# EAGLE design untitled01 (EAGLE 8.4.0)

## Sheet 1 of 3
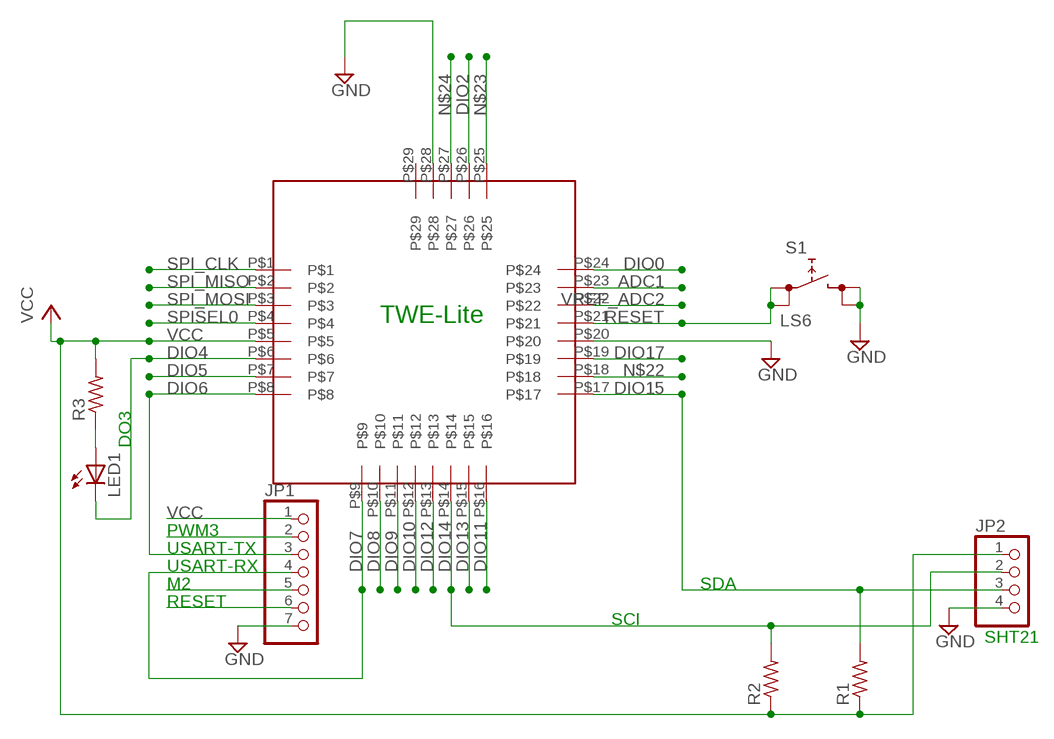
[diagram p0: schematic, sheet 1]

### Parts
JP1  PINHD-1X7  [1X07]
JP2  PINHD-1X4/90  [1X04/90]
LED1  LEDCHIP-LED0603  [CHIP-LED0603]
R1  R-US_R0805  [R0805]
R2  R-US_R0805  [R0805]
R3  R-US_R0805  [R0805]
S1  LS6  [LS6]
U$1  LITE  [LITE]

### Nets
ADC1: U$1.P$23
DIO0: U$1.P$24
DIO2: JP1.5 U$1.P$26
DIO4: LED1.C U$1.P$6
DIO5: U$1.P$7
DIO6: JP1.3 U$1.P$8
DIO7: JP1.4 U$1.P$9
DIO8: U$1.P$10
DIO9: U$1.P$11
DIO10: U$1.P$12
DIO11: U$1.P$16
DIO12: U$1.P$13
DIO13: U$1.P$15
DIO14: JP2.2 R2.2 U$1.P$14
DIO15: JP2.3 R1.2 U$1.P$17
DIO17: U$1.P$19
GND: JP1.7 JP2.4 S1.P$3 S1.P$4 U$1.P$20 U$1.P$28 ; also sheet 2,3
N$3: LED1.A R3.1
N$22: U$1.P$18
N$23: U$1.P$25
N$24: U$1.P$27
RESET: JP1.6 S1.P$1 S1.P$2 U$1.P$21
SPI_CLK: U$1.P$1
SPI_MISO: JP1.2 U$1.P$2
SPI_MOSI: U$1.P$3
SPISEL0: U$1.P$4
VCC: JP1.1 JP2.1 R1.1 R2.1 R3.2 U$1.P$5 ; also sheet 2
VREF_ADC2: U$1.P$22
Unconnected: U$1.P$29

### Notes on the sheet
- TWE-Lite
- DO3
- PWM3
- USART-TX
- USART-RX
- M2 | SDA
- RESET
- SCI
- SHT21

## Sheet 2 of 3
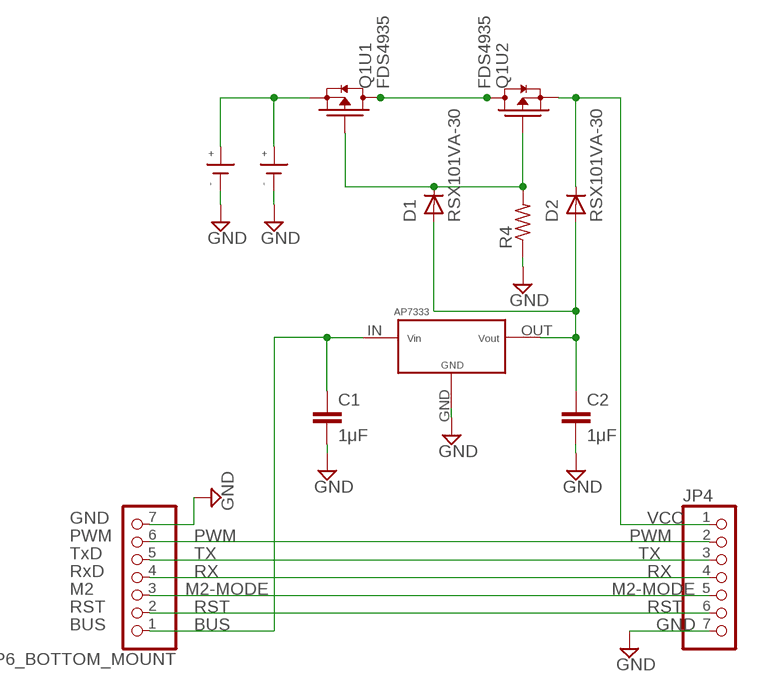
[diagram p1: schematic, sheet 2]

### Parts
C1  1μF  C-EUC1608  [C1608]
C2  1μF  C-EUC1608  [C1608]
D1  RSX101VA-30  [RSX101VA]
D2  RSX101VA-30  [RSX101VA]
JP4  PINHD-1X7  [1X07]
JP6_BOTTOM_MOUNT  PINHD-1X7  [1X07]
Q1  FDS4935  [SOIC(8PIN)]
R4  R-US_M0805  [M0805]
U$2  CH004-2032LF  [CH004-2032LF]
U$3  CH004-2032LF  [CH004-2032LF]
U$5  AP7333_SOT-23  [AP7333_SOT-23]

### Nets
BAT: Q1.1(U1:S) U$2.+ U$3.+
BUS: C1.1 JP6_BOTTOM_MOUNT.1 U$5.IN
GND: C1.2 C2.2 JP4.7 JP6_BOTTOM_MOUNT.7 R4.1 U$2.- U$3.- U$5.GND ; also sheet 1,3
M2-MODE: JP4.5 JP6_BOTTOM_MOUNT.3
N$6: D1.CATHODE(C) Q1.2(U1:G) Q1.4(U2:G) R4.2
N$7: Q1.5(U2:D2) Q1.6(U2:D1) Q1.7(U1:D2) Q1.8(U1:D1)
PWM: JP4.2 JP6_BOTTOM_MOUNT.6
RST: JP4.6 JP6_BOTTOM_MOUNT.2 ; also sheet 3
RX: JP4.4 JP6_BOTTOM_MOUNT.4
TX: JP4.3 JP6_BOTTOM_MOUNT.5
USB_BUS: C2.1 D1.ANODE(A) D2.ANODE(A) U$5.OUT
VCC: D2.CATHODE(C) JP4.1 Q1.3(U2:S) ; also sheet 1

### Notes on the sheet
- GND
- PWM
- TxD
- RxD
- M2
- RST
- BUS

## Sheet 3 of 3
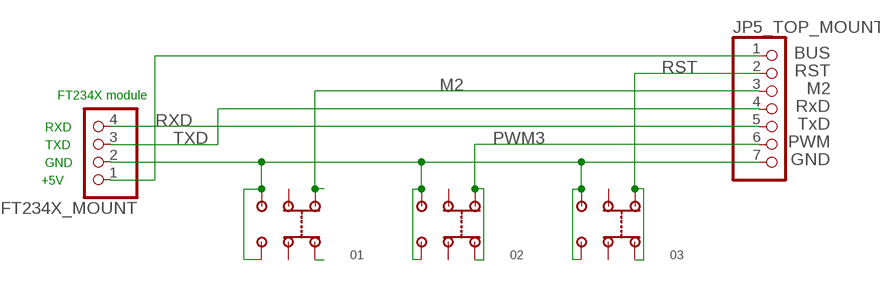
[diagram p2: schematic, sheet 3]

### Parts
01  SSSS213202  [SSSS213202]
02  SSSS213202  [SSSS213202]
03  SSSS213202  [SSSS213202]
FT234X_MOUNT  PINHD-1X4  [1X04]
JP5_TOP_MOUNT  PINHD-1X7  [1X07]

### Nets
BUS_POWER: FT234X_MOUNT.1 JP5_TOP_MOUNT.1
GND: 01.3-1 01.3-2 02.3-1 02.3-2 03.3-1 03.3-2 FT234X_MOUNT.2 JP5_TOP_MOUNT.7 ; also sheet 1,2
M2: 01.1-2 JP5_TOP_MOUNT.3
N$2: 01.1-1
PWM3: 02.1-1 02.1-2 JP5_TOP_MOUNT.6
RST: 03.1-1 03.1-2 JP5_TOP_MOUNT.2 ; also sheet 2
RXD: FT234X_MOUNT.4 JP5_TOP_MOUNT.5
TXD: FT234X_MOUNT.3 JP5_TOP_MOUNT.4
Unconnected: 01.2-1 01.2-2 02.2-1 02.2-2 03.2-1 03.2-2

### Notes on the sheet
- BUS
- RST
- M2
- FT234X module | RxD
- TxD
- RXD | PWM
- TXD | GND
- GND
- +5V

## Library data of the parts
01-03 = SSSS213202:SSSS213202
C1 C2 = rcl:C-EU: CAPACITOR, European symbol
D1 D2 = diodes:RSX101VA-30
FT234X_MOUNT JP2 = pinhead:PINHD-1X4: PIN HEADER
JP1 JP4 JP5_TOP_MOUNT JP6_BOTTOM_MOUNT = pinhead:PINHD-1X7: PIN HEADER
LED1 = led:LED: LED OSRAM: - CHIPLED LG R971, LG N971, LY N971, LG Q971, LY Q971, LO R971, LY R971 LH N974, LH R974 LS Q976, LO Q976, LY Q976 LO Q996 - Hyper CHIPLED LW Q18S LB Q993, LB Q99A, LB R99A - SideLED LS A670, LO A670, LY A670, LG A670, LP A670 LB A673, LV A673, LT A673, LW A673 LH A674 LY A675 LS A676, LA A676, LO A676, LY A676, LW A676 LS A679, LY A679, LG A679 - Hyper Micro SIDELED® LS Y876, LA Y876, LO Y876, LY Y876 LT Y87S - SmartLED LW L88C, LW L88S LB L89C, LB L89S, LG L890 LS L89K, LO L89K, LY L89K LS L896, LA L896, LO L896, LY L896 - TOPLED LS T670, LO T670, LY T670, LG T670, LP T670 LSG T670, LSP T670, LSY T670, LOP T670, LYG T670 LG T671, LOG T671, LSG T671 LB T673, LV T673, LT T673, LW T673 LH T674 LS T676, LA T676, LO T676, LY T676, LB T676, LH T676, LSB T676, LW T676 LB T67C, LV T67C, LT T67C, LS T67K, LO T67K, LY T67K, LW E67C LS E67B, LA E67B, LO E67B, LY E67B, LB E67C, LV E67C, LT E67C LW T67C LS T679, LY T679, LG T679 LS T770, LO T770, LY T770, LG T770, LP T770 LB T773, LV T773, LT T773, LW T773 LH T774 LS E675, LA E675, LY E675, LS T675 LS T776, LA T776, LO T776, LY T776, LB T776 LHGB T686 LT T68C, LB T68C - Hyper Mini TOPLED® LB M676 - Mini TOPLED Santana® LG M470 LS M47K, LO M47K, LY M47K Source: http://www.osram.convergy.de LUXEON: - LUMILED® LXK2-PW12-R00, LXK2-PW12-S00, LXK2-PW14-U00, LXK2-PW14-V00 LXK2-PM12-R00, LXK2-PM12-S00, LXK2-PM14-U00 LXK2-PE12-Q00, LXK2-PE12-R00, LXK2-PE12-S00, LXK2-PE14-T00, LXK2-PE14-U00 LXK2-PB12-K00, LXK2-PB12-L00, LXK2-PB12-M00, LXK2-PB14-N00, LXK2-PB14-P00, LXK2-PB14-Q00 LXK2-PR12-L00, LXK2-PR12-M00, LXK2-PR14-Q00, LXK2-PR14-R00 LXK2-PD12-Q00, LXK2-PD12-R00, LXK2-PD12-S00 LXK2-PH12-R00, LXK2-PH12-S00 LXK2-PL12-P00, LXK2-PL12-Q00, LXK2-PL12-R00 Source: www.luxeon.com KINGBRIGHT: KA-3528ASYC Source: www.kingbright.com
Q1 = FET p-ch:FDS4935
R1-R3 = rcl:R-US_: RESISTOR, American symbol
R4 = resistor:R-US_: RESISTOR, American symbol
S1 = switch:LS6
U$1 = TWELite:LITE
U$2 U$3 = CH004-2032LF:CH004-2032LF
U$5 = Three-terminal regulator:AP7333_SOT-23

## Board
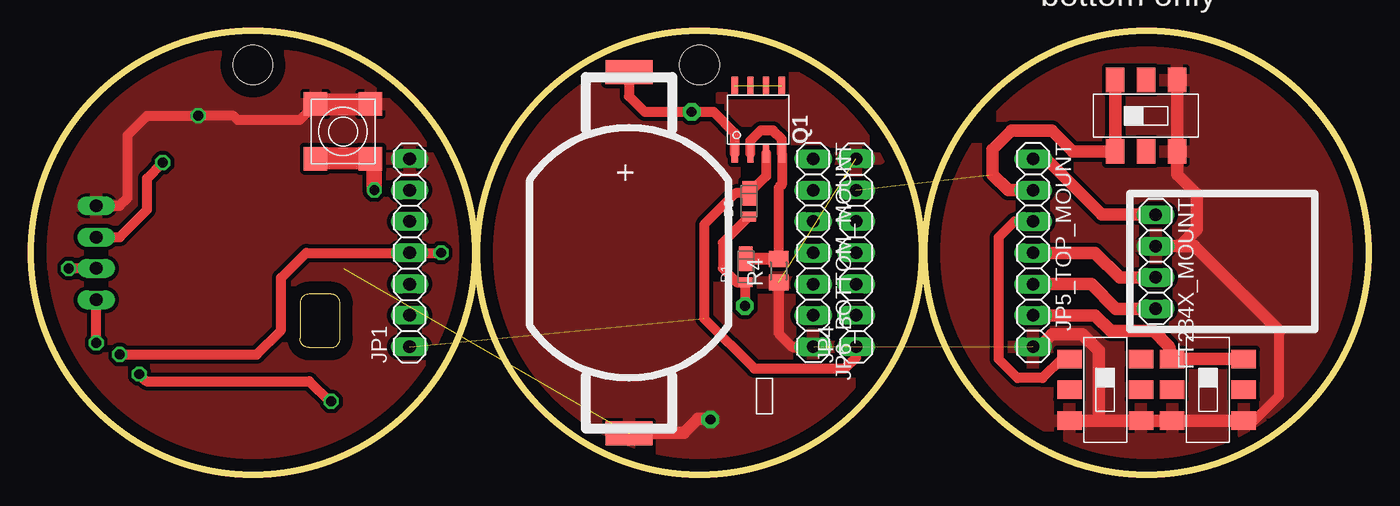
[diagram p3: board, top side]
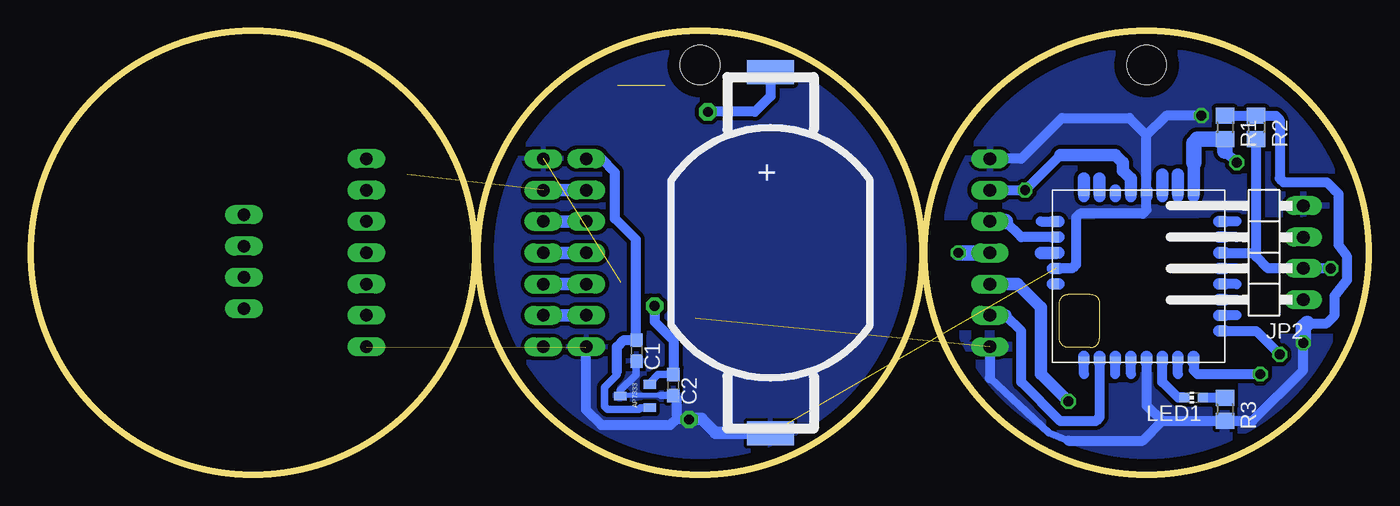
[diagram p4: board, bottom side, seen from below]

Size 108.44 x 36 mm. Coordinates in mm from the lower left corner, seen from the top.
Outline: circle at 18,18 radius 18
Outline: circle at 54.19,18 radius 18
Outline: circle at 90.44,18 radius 18
Copper layers (1*16): Top 0.035mm / dielectric 1.5mm / Bottom 0.035mm
Design rules "default *": minimum track width 12.5mil, minimum drill 24mil, track to track 12.5mil, track to pad 12.5mil, pad to pad 12.5mil, via to via 12.5mil, smd to smd 12.5mil, copper to edge 40mil, drill to drill 12.5mil, minimum pad ring 10mil, minimum via ring 8mil, stop-mask expansion 4mil, vias tented up to drill 0mil, thermal gap 10mil
Holes 3.2 mm at 18,33.24 54.19,33.24

### Footprints (pad centres in the part's own frame; a part is rotated, then mirrored left to right if it is on the bottom)
SSSS213202 = smd 1.5 x 2: 1-1 -2.5,2.9; 1-2 -2.5,-2.9; 2-1 0,2.9; 2-2 0,-2.9; 3-1 2.5,2.9; 3-2 2.5,-2.9
C1608 = smd 1.1 x 1: 1 -0.85,0; 2 0.85,0
RSX101VA = smd 0.8 x 1.1: ANODE -1.25,0 | smd 2 x 1.1: CATHODE 0.65,0
1X04 = drill 1.016 long: 1 -3.81,0; 2 -1.27,0; 3 1.27,0; 4 3.81,0
1X07 = drill 1.016 long: 1 -7.62,0; 2 -5.08,0; 3 -2.54,0; 4 0,0; 5 2.54,0; 6 5.08,0; 7 7.62,0
1X04/90 = drill 1.016 long: 1 -3.81,-3.81; 2 -1.27,-3.81; 3 1.27,-3.81; 4 3.81,-3.81
CHIP-LED0603 = smd 0.8 x 0.8: A 0,-0.75; C 0,0.75
SOIC(8PIN) = smd 1.5 x 0.5: 1 -2.74,1.905; 2 -2.74,0.635; 3 -2.74,-0.635; 4 -2.74,-1.905; 5 2.74,-1.905; 6 2.74,-0.635; 7 2.74,0.635; 8 2.74,1.905
R0805 = smd 1.3 x 1.5: 1 -0.95,0; 2 0.95,0
M0805 = smd 1.3 x 1.6: 1 -0.95,0; 2 0.95,0
LS6 = smd 1.905 x 1.905: P$1 -2.223,2.223; P$2 -2.223,-2.223; P$3 2.223,2.223; P$4 2.223,-2.223
LITE = smd 0.5 x 0.9: P$1 0.25,11.43; P$2 0.25,10.16; P$3 0.25,8.89; P$4 0.25,7.62; P$5 0.25,6.35; P$6 0.25,5.08; P$7 0.25,3.81; P$8 0.25,2.54; P$17 13.72,2.54; P$18 13.72,3.81; P$19 13.72,5.08; P$20 13.72,6.35; P$21 13.72,7.62; P$22 13.72,8.89; P$23 13.72,10.16; P$24 13.72,11.43 | smd 0.9 x 0.5: P$9 2.54,0.25; P$10 3.81,0.25; P$11 5.08,0.25; P$12 6.35,0.25; P$13 7.62,0.25; P$14 8.89,0.25; P$15 10.16,0.25; P$16 11.43,0.25; P$25 11.43,13.72; P$26 10.16,13.72; P$27 8.89,13.72; P$28 7.62,13.72; P$29 6.35,13.72
CH004-2032LF = smd 1.93 x 3.81: + -14.65,0; - 14.65,0
AP7333_SOT-23 = smd 0.7 x 1: GND 0,1.2; IN -0.95,-1.2; OUT 0.95,-1.2

### Placement (x,y rotation side)
01  87.09,6.89 270 top
02  95.41,6.89 270 top
03  90.39,29.11 0 top
C1  59.34,10.06 270 bottom
C2  56.35,7.27 270 bottom
D1  57.96,16.86 90 top
D2  58.21,22.18 90 top
FT234X_MOUNT  91.17,17.27 270 top
JP1  30.7,18 90 top
JP2  9.11,18 90 bottom
JP4  66.89,18 90 top
JP5_TOP_MOUNT  81.23,18 270 top
JP6_BOTTOM_MOUNT  63.4,18 270 top
LED1  14.19,6.25 90 bottom
Q1  58.96,28.79 90 top
R1  11.65,28.16 270 bottom
R2  9.11,28.16 270 bottom
R3  11.65,5.3 270 bottom
R4  60.61,16.54 90 top
S1  25.3,27.84 90 top
U$1  11.65,9.11 90 bottom
U$2  48.48,18 270 bottom
U$3  48.48,18 270 top
U$5  59.47,6.38 90 bottom

### Tracks (layer width: path | path; a pad name or v marks a point on that pad's centre or on a via)
ADC1
  Bottom 1.016: 21.81,24.03 U$1.P$23
BAT  (via drill 0.8 pad 1.42)
  Top 0.813: U$3.+ 48.48,30.7 49.75,29.43 v53.56,29.43 55.34,29.43 57.05,27.71 Q1.1
  Bottom 0.813: U$3.+ 48.48,30.7 49.75,29.43 v53.56,29.43
BUS
  Bottom 0.61: U$5.IN 59.02,5.43 59.15,5.3 61.69,5.3 61.94,5.55 61.94,7.08 60.93,8.09 60.93,8.35
  Bottom 0.813: JP6_BOTTOM_MOUNT.1 62.2,25.62 61.08,24.51 61.08,20.76 59.4,19.08 59.4,10.98 C1.1 60.39,10.91 60.93,10.38 60.93,8.35
BUS_POWER
  Top 1.016: JP5_TOP_MOUNT.1 82.26,25.62 86.8,21.08 FT234X_MOUNT.1
DIO0
  Bottom 1.016: 23.08,24.03 U$1.P$24
DIO2
  Bottom 0.813: U$1.P$26 28.16,19.27 29.43,20.54
  Bottom 1.27: JP1.5 29.43,20.54
DIO4
  Bottom 0.813: LED1.C 15.46,6.25 16.73,7.52 16.73,7.84 U$1.P$6
DIO5
  Bottom 0.813: 15.46,8.16 U$1.P$7
DIO6  (via drill 0.8)
  Top 0.813: v8.79,8.16 9.36,7.59 22.57,7.59 24.22,5.93 v24.35,5.93
  Bottom 0.813: U$1.P$8 14.19,8.47 13.87,8.16 v8.79,8.16
  Bottom 1.016: JP1.3 28.48,15.46 26.57,13.55 26.57,8.16 v24.35,5.93
DIO7  (via drill 0.8)
  Top 0.813: v7.21,9.74 18.32,9.74 20.29,11.71 20.29,15.97 22.32,18 v33.24,18
  Bottom 0.813: U$1.P$9 9.11,11.65 v7.21,9.74
  Bottom 1.27: JP1.4 v33.24,18
DIO8
  Bottom 0.813: 10.7,12.92 U$1.P$10
DIO9
  Bottom 0.813: 10.7,14.19 U$1.P$11
DIO10
  Bottom 0.813: 10.7,15.46 U$1.P$12
DIO11
  Bottom 0.813: 10.7,20.54 U$1.P$16
DIO12
  Bottom 0.813: 10.7,16.73 U$1.P$13
DIO13
  Bottom 0.813: 10.7,19.27 U$1.P$15
DIO14  (via drill 0.8)
  Top 0.813: JP2.2 v3.08,16.73
  Bottom 0.813: U$1.P$14 9.43,18 9.11,18 | 9.11,18 R2.2 | v3.08,16.73 8.16,16.73 9.11,17.68 9.11,18
DIO15  (via drill 0.8)
  Top 0.813: v10.7,25.3 9.43,24.03 9.43,21.49 7.21,19.27 JP2.3
  Bottom 0.813: 11.65,26.25 v10.7,25.3
  Bottom 1.016: U$1.P$17 14.19,25.3
  Bottom 1.27: 14.19,25.3 14.19,26.89 13.87,27.21 R1.2 11.65,26.25
DIO17
  Bottom 1.016: 16.73,24.35 U$1.P$19
GND  (via drill 0.8, 0.8 pad 1.42)  (3 unrouted)
  Top 0.813: JP2.4 7.21,21.81 7.84,22.45 7.84,27.52 9.43,29.11 v13.55,29.11 16.41,29.11 16.73,28.79 21.81,28.79 S1.P$3 | R4.1 60.61,11.46 61.69,10.38 JP6_BOTTOM_MOUNT.7 | 98.09,4.35 99.09,4.35 101.19,6.44 101.19,11.65
  Top 1.016: U$3.- 48.53,3.39 52.92,3.39 54.07,4.54 55.02,4.54 v55.08,4.47 | 93.15,18.54 FT234X_MOUNT.2 | 93.15,18.54 94.52,19.9 94.52,22.76 92.93,24.35 92.93,26.17 | 92.93,26.17 03.3-2 | 03.3-1 92.93,31.97 92.93,26.17 | 86.58,4.39 01.3-2 | 86.58,4.39 01.3-1 02.3-2 02.3-1 98.09,4.35 | 101.19,11.65 94.3,18.54 93.15,18.54 | 86.58,4.39 86.58,10.06 85.25,11.4 82.77,11.4 81.75,10.38 JP5_TOP_MOUNT.7
  Top 1.778: S1.P$3 S1.P$4
  Bottom 0.406: 57.37,6.42 60.67,6.42 U$5.GND
  Bottom 0.61: C2.2 57.37,6.42 | C1.2 59.4,9.15 59.4,8.09 60.67,6.83 60.67,6.42
  Bottom 0.813: v13.55,29.11 16.41,29.11 18,27.52 | JP1.7 28.16,25.62 24.86,28.92 19.4,28.92 18,27.52 | U$1.P$28 24.03,16.73 23.71,17.05 23.71,20.86 23.4,21.18 18.32,21.18 18,21.49 U$1.P$20 18,27.52 | 56.52,6.25 C2.2 56.1,6.16 56.1,4.54 | JP6_BOTTOM_MOUNT.7 63.47,10.32 63.47,5.3 62.2,4.03 56.61,4.03 56.1,4.54 | 56.1,4.54 55.02,4.54
  Bottom 1.016: U$3.- 48.53,3.39 52.92,3.39 54.07,4.54 55.02,4.54 v55.08,4.47
  pour Bottom: 37.37,18 arc90 54.19,1.17 arc90 71.02,18 arc90 54.19,34.83 arc90
  pour Top: -1.05,-1.05 -1.05,37.05 109.37,37.37 109.37,-0.73
  pour Top: 1.17,18.95 arc-90 18.32,34.83 arc-90 34.83,18 arc-90 18,1.17 arc-90
  pour Bottom: 34.83,20.86 1.17,21.18 arc-75 18,34.83 arc-75
M2
  Top 0.813: 01.1-2 83.56,9.39 82.01,7.84 79.98,7.84 78.45,9.36 78.45,19.27 79.72,20.54 JP5_TOP_MOUNT.3
M2-MODE
  Bottom 1.016: JP6_BOTTOM_MOUNT.3 JP4.5
N$3
  Bottom 0.813: LED1.A 12.6,6.25 R3.1
  Bottom 1.27: R3.1
N$6
  Top 0.813: Q1.2 58.32,27.08 59.15,27.91 60.16,27.91 60.86,27.21 Q1.4 60.86,23.52 60.61,23.27 60.61,17.59 60.56,17.54
  Top 1.016: D1.CATHODE 60.56,17.54 R4.2
N$7  (3 unrouted)
N$22
  Bottom 1.016: 15.46,24.35 U$1.P$18
N$23
  Bottom 0.813: 26.57,20.54 U$1.P$25
N$24
  Bottom 1.016: 26.57,18 U$1.P$27
PWM
  Bottom 1.016: JP6_BOTTOM_MOUNT.6 JP4.2
PWM3
  Top 1.016: 02.1-1 02.1-2 92.25,10.42 91.03,11.65 87.53,11.65 86.26,12.92 JP5_TOP_MOUNT.6
RESET  (via drill 0.8)
  Top 1.27: v27.84,23.08 27.84,25.3 S1.P$2
  Top 1.778: S1.P$2 S1.P$1
  Bottom 0.813: 24.98,25.94 v27.84,23.08 JP1.6
  Bottom 1.016: U$1.P$21 19.27,24.03 19.9,24.67 19.9,25.3 20.54,25.94 24.98,25.94
RST  (1 unrouted)
  Top 1.016: 03.1-1 03.1-2 84.46,26.21 82.77,27.91 79.47,27.91 77.94,26.38 77.94,24.35 79.21,23.08 JP5_TOP_MOUNT.2
  Bottom 1.016: JP6_BOTTOM_MOUNT.2 JP4.6
RX
  Bottom 1.016: JP6_BOTTOM_MOUNT.4 JP4.4
RXD
  Top 1.016: FT234X_MOUNT.4 87.95,13.46 85.95,15.46 JP5_TOP_MOUNT.5
SPI_CLK
  Bottom 0.813: 23.08,8.16 U$1.P$1
SPI_MISO
  Bottom 0.813: U$1.P$2 21.81,4.66 22.13,4.35 24.98,4.35 28.16,7.52 28.16,11.65 29.43,12.92
  Bottom 1.016: 29.43,12.92 JP1.2
SPI_MOSI
  Bottom 0.813: 20.54,8.16 U$1.P$3
SPISEL0
  Bottom 0.813: 19.27,8.16 U$1.P$4
TX
  Bottom 1.016: JP6_BOTTOM_MOUNT.5 JP4.3
TXD
  Top 1.016: FT234X_MOUNT.3 88.26,16 86.26,18 JP5_TOP_MOUNT.4
USB_BUS  (via drill 0.8 pad 1.42)
  Top 0.813: D2.ANODE 56.1,18.81 56.1,16.73 57.22,15.61 D1.ANODE 57.88,15.53 v57.88,13.68
  Bottom 0.61: U$5.OUT 58.27,7.45 57.6,8.12 C2.1
  Bottom 0.813: C2.1 56.35,10.89 57.88,12.41 v57.88,13.68
VCC  (via drill 0.8)  (1 unrouted)
  Top 0.813: v5.3,10.7 JP2.1 | Q1.3 59.59,24.2 D2.CATHODE 57.11,22.82 54.58,20.29 54.58,12.67 58.64,8.6 66.01,8.6 66.89,9.49 JP4.1
  Bottom 0.61: 30.7,7.84 25.94,3.39 24.35,2.76
  Bottom 0.813: v5.3,10.7 5.3,8.47 9.42,4.35 R3.2 16.73,4.35 | R1.1 R2.1 7.52,29.11 7.21,28.79 7.21,24.03 6.89,23.71 3.39,23.71 2.76,23.08 2.44,22.76 2.44,18.63 1.74,17.68 1.74,15.78 2.76,14.51 2.76,12.92 3.39,12.29 4.98,12.29 | JP1.1 30.7,7.84 | U$1.P$5 18,5.62 16.73,4.35 | 24.35,2.76 18.32,2.76 16.73,4.35
  Bottom 1.27: v5.3,10.7 5.3,11.97 4.98,12.29
  pour Bottom: 2.76,11.01 33.56,11.33 arc-70 17.05,1.17 18.32,1.17 arc-70

### Text on the board
tNames: bottom only